# EAGLE design orbA (EAGLE 5.11)
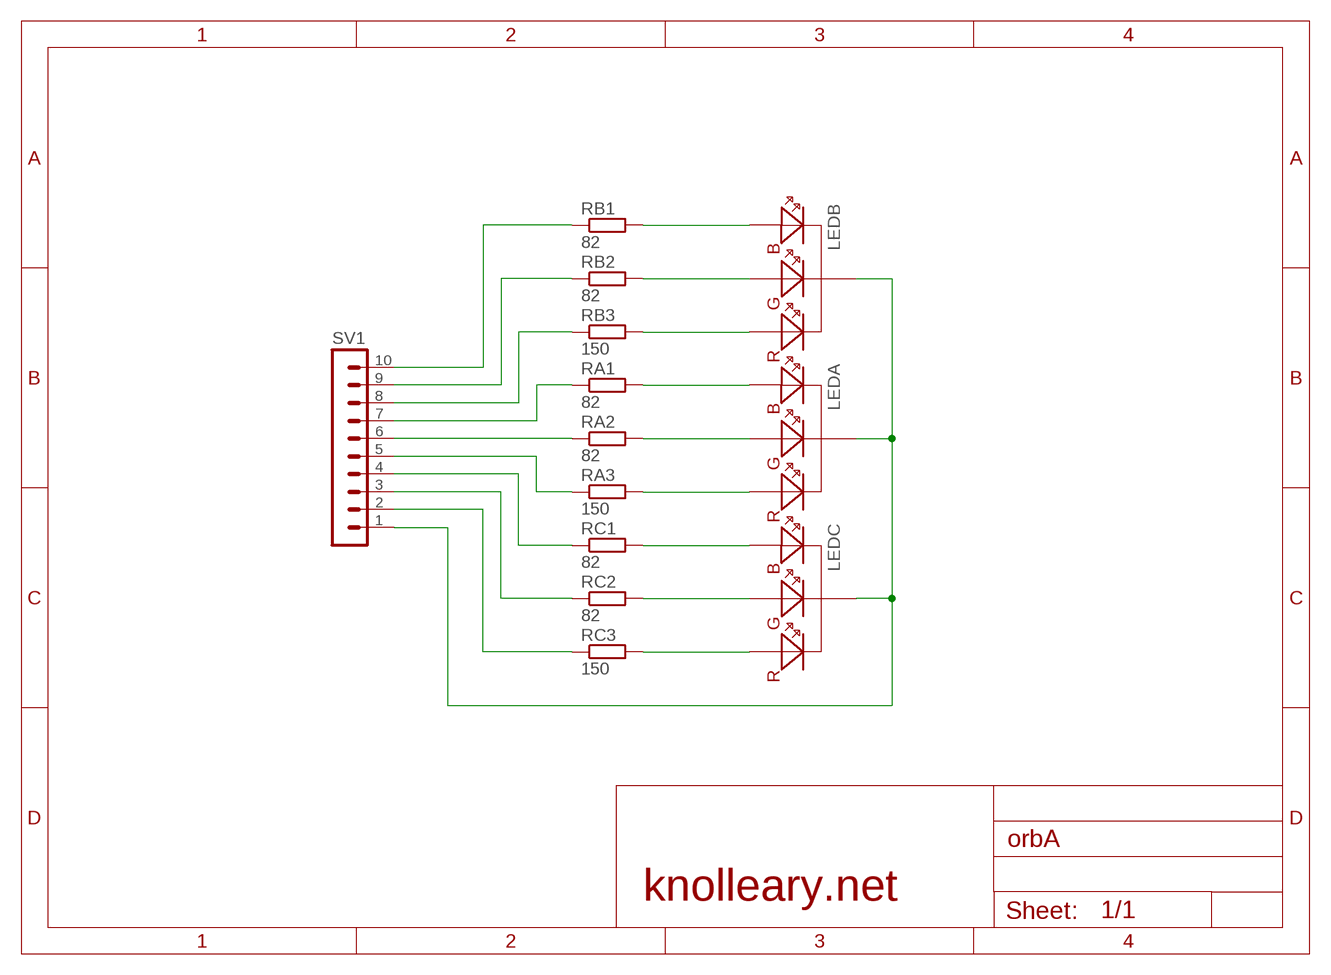
[diagram p0: schematic, sheet 1]

## Parts
LEDA  MULTICOLORLED  [MULTICOLORLED]
LEDB  MULTICOLORLED  [MULTICOLORLED]
LEDC  MULTICOLORLED  [MULTICOLORLED]
RA1  82  R-EU_M1206  [M1206]
RA2  82  R-EU_M1206  [M1206]
RA3  150  R-EU_M1206  [M1206]
RB1  82  R-EU_M1206  [M1206]
RB2  82  R-EU_M1206  [M1206]
RB3  150  R-EU_M1206  [M1206]
RC1  82  R-EU_M1206  [M1206]
RC2  82  R-EU_M1206  [M1206]
RC3  150  R-EU_M1206  [M1206]
SV1  MA10-1  [MA10-1]

## Nets
GND: LEDA.GND LEDB.GND LEDC.GND SV1.1
N$1: LEDB.LED-B RB1.2
N$2: LEDB.LED-G RB2.2
N$3: LEDB.LED-R RB3.2
N$4: LEDA.LED-B RA1.2
N$5: LEDA.LED-G RA2.2
N$6: LEDA.LED-R RA3.2
N$7: LEDC.LED-B RC1.2
N$8: LEDC.LED-G RC2.2
N$9: LEDC.LED-R RC3.2
N$11: RB1.1 SV1.10
N$12: RB2.1 SV1.9
N$13: RB3.1 SV1.8
N$14: RA1.1 SV1.7
N$15: RA2.1 SV1.6
N$16: RA3.1 SV1.5
N$17: RC1.1 SV1.4
N$18: RC2.1 SV1.3
N$19: RC3.1 SV1.2

## Library data of the parts
LEDA LEDB LEDC = knolleary:MULTICOLORLED
RA1-RA3 RB1-RB3 RC1-RC3 = resistor:R-EU_: RESISTOR, European symbol
SV1 = con-lstb:MA10-1: PIN HEADER; OC_FARNELL: unknown; OC_NEWARK: unknown

## Board
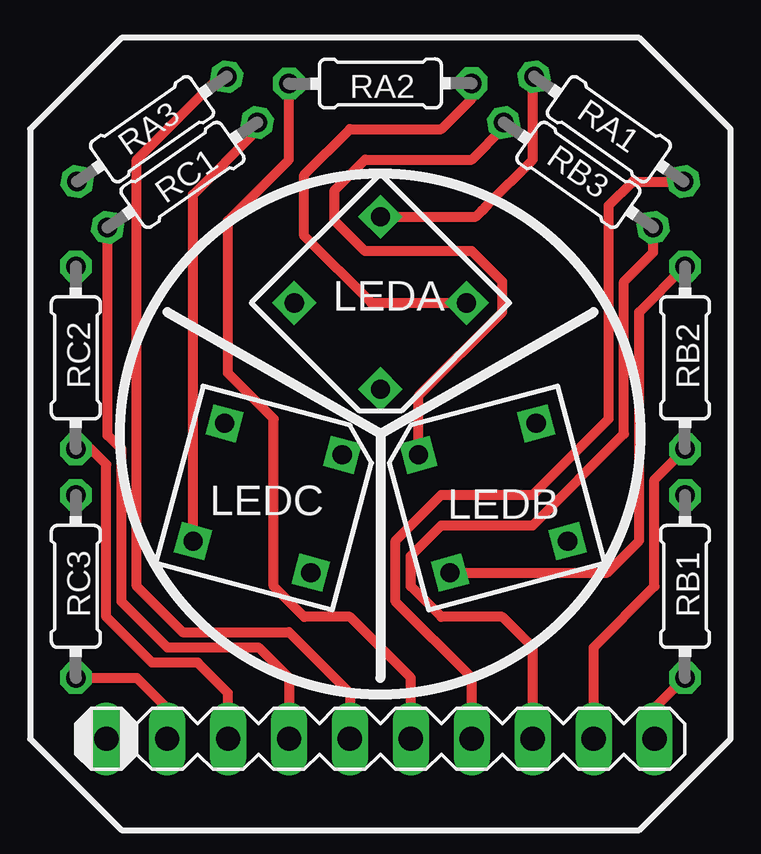
[diagram p1: board, top side]
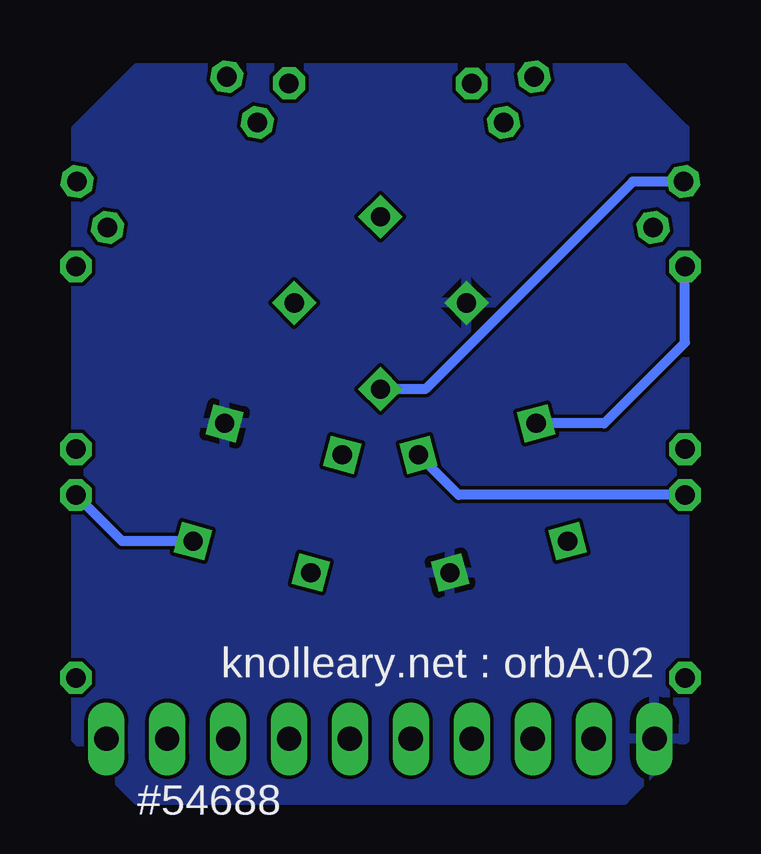
[diagram p2: board, bottom side, seen from below]

No outline drawn. Coordinates in mm, seen from the top.
Copper layers (1*16): Top 0.035mm / dielectric 1.5mm / Bottom 0.035mm
Design rules "Fusion_eagle_rule_v1.1": minimum track width 6mil, minimum drill 12mil, track to track 6mil, track to pad 6mil, pad to pad 6mil, via to via 6mil, smd to smd 0mil, copper to edge 10mil, drill to drill 10mil, minimum pad ring 10mil, minimum via ring 6mil, stop-mask expansion 2mil, vias tented up to drill 100mil, thermal gap 10mil

### Footprints (pad centres in the part's own frame; a part is rotated, then mirrored left to right if it is on the bottom)
MULTICOLORLED = drill 0.8 square: GND -2.54,-2.54; LED-B -2.54,2.54; LED-G 2.54,2.54; LED-R 2.54,-2.54
0204/7 = drill 0.813 octagon: 1 -3.81,0; 2 3.81,0
MA10-1 = drill 1.016 long: 1 -11.43,0; 2 -8.89,0; 3 -6.35,0; 4 -3.81,0; 5 -1.27,0; 6 1.27,0; 7 3.81,0; 8 6.35,0; 9 8.89,0; 10 11.43,0

### Placement (x,y rotation side)
LEDA  15.24,21.97 315 top
LEDB  19.94,13.84 195 top
LEDC  10.54,13.84 75 top
RA1  82  [0204/7]  24.77,29.21 145 top
RA2  82  [0204/7]  15.24,31.11 0.1 top
RA3  150  [0204/7]  5.71,29.21 215 top
RB1  82  [0204/7]  27.94,10.16 90 top
RB2  82  [0204/7]  27.94,19.68 90 top
RB3  150  [0204/7]  23.5,27.3 145 top
RC1  82  [0204/7]  6.99,27.3 35 top
RC2  82  [0204/7]  2.54,19.68 90 top
RC3  150  [0204/7]  2.54,10.16 90 top
SV1  15.24,3.81 0 top

### Tracks (layer width: path | path; a pad name or v marks a point on that pad's centre or on a via)
GND
  pour Bottom: 2.54,29.21 5.08,31.75 25.4,31.75 27.94,29.21 27.94,3.81 25.4,1.27 5.08,1.27 2.54,3.81
N$1
  Bottom 0.406: LEDB.LED-B 26.02,12.05 RB1.2
N$2
  Top 0.406: RB2.2 26.04,21.59 26.04,12.06 24.7,10.73 LEDB.LED-G
N$3
  Top 0.406: RB3.2 20.37,29.26 19.05,27.94 14.61,27.94 13.34,26.67 13.34,25.4 14.61,24.13 19.05,24.13 20.32,22.86 20.32,21.59 16.83,18.1 LEDB.LED-R
N$4
  Top 0.406: RA1.2 21.59,31.34 21.59,27.94 19.68,26.04 19.47,25.82 19.21,25.56 LEDA.LED-B
N$5
  Top 0.406: RA2.2 19.05,30.48 17.78,29.21 13.97,29.21 12.06,27.3 12.06,24.77 14.86,21.97 LEDA.LED-G
N$6
  Bottom 0.406: RA3.2 4.72,27.02 13.37,18.38 LEDA.LED-R
N$7
  Top 0.406: RC1.2 10.11,29.16 7.43,26.48 LEDC.LED-B
N$8
  Bottom 0.406: RC2.2 2.54,20.32 5.91,16.95 LEDC.LED-G
N$9
  Bottom 0.406: RC3.2 11.98,13.97 LEDC.LED-R
N$11
  Top 0.406: SV1.10 26.67,5.08 RB1.1
N$12
  Top 0.406: SV1.9 24.13,7.62 26.67,10.16 26.67,14.61 RB2.1
N$13
  Top 0.406: RB3.1 26.62,24.08 25.4,22.86 25.4,16.51 21.59,12.7 17.78,12.7 16.51,11.43 16.51,10.16 17.78,8.89 20.32,8.89 21.59,7.62 SV1.8
N$14
  Top 0.406: RA1.1 25.75,27.02 24.77,26.04 24.77,17.14 21.59,13.97 17.78,13.97 15.88,12.06 15.88,9.53 19.05,6.35 SV1.7
N$15
  Top 0.406: RA2.1 11.43,27.94 8.89,25.4 8.89,19.05 10.79,17.14 10.79,10.16 12.06,8.89 13.97,8.89 16.51,6.35 SV1.6
N$16
  Top 0.406: RA3.1 8.54,31.39 5.08,27.94 5.08,10.16 6.99,8.26 11.43,8.26 13.97,5.71 SV1.5
N$17
  Top 0.406: SV1.4 11.43,6.35 10.16,7.62 6.35,7.62 4.45,9.53 4.45,15.88 3.86,16.46 RC1.1
N$18
  Top 0.406: RC2.1 3.17,15.88 3.81,15.24 3.81,8.89 5.71,6.99 7.62,6.99 8.89,5.71 SV1.3
N$19
  Top 0.406: RC3.1 5.08,6.35 6.35,5.08 SV1.2

### Text on the board
bPlace: knolleary.net : orbA:02 | #54688